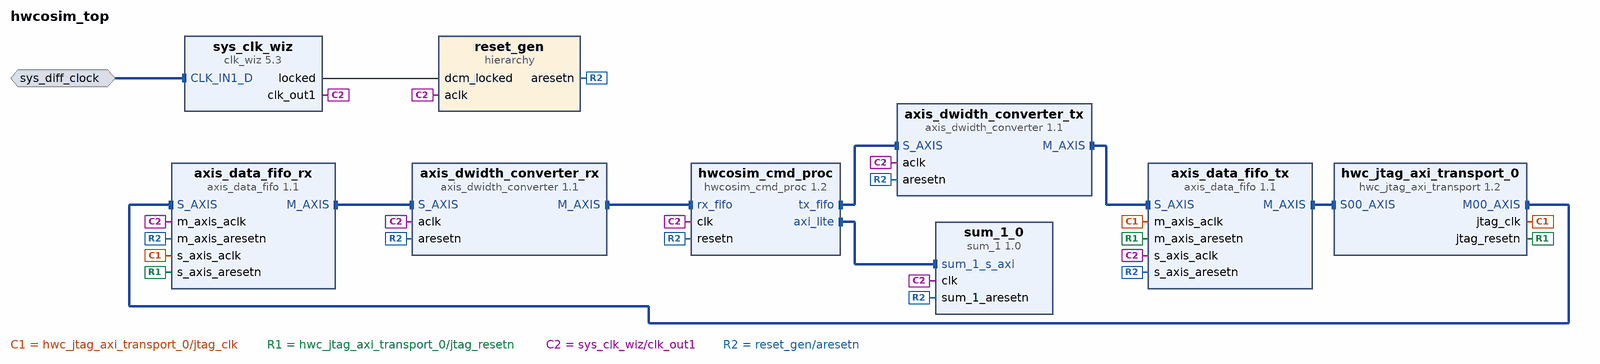
[diagram p0: block diagram of the top level]
# Vivado block design hwcosim_top, Vivado 2016.1
create_bd_design hwcosim_top

create_bd_intf_port -mode Slave -vlnv xilinx.com:interface:diff_clock_rtl:1.0 sys_diff_clock
set_property -dict {CONFIG.FREQ_HZ 200000000} [get_bd_intf_ports sys_diff_clock]

create_bd_cell -type ip -vlnv xilinx.com:ip:clk_wiz:5.3 sys_clk_wiz
set_property -dict [list \
  CONFIG.CLKOUT1_REQUESTED_OUT_FREQ 50.000 \
  CONFIG.MMCM_DIVCLK_DIVIDE 1 \
  CONFIG.MMCM_CLKFBOUT_MULT_F 5.000 \
  CONFIG.MMCM_CLKOUT0_DIVIDE_F 20.000 \
  CONFIG.USE_BOARD_FLOW true \
  CONFIG.CLK_IN1_BOARD_INTERFACE sys_diff_clock \
  CONFIG.CLKOUT1_JITTER 129.198 \
  CONFIG.CLKOUT1_PHASE_ERROR 89.971 \
] [get_bd_cells sys_clk_wiz]
create_bd_cell -type ip -vlnv xilinx.com:hwcosim:hwc_jtag_axi_transport:1.2 hwc_jtag_axi_transport_0
set_property -dict {CONFIG.HWC_JTAG_SCAN_CHAIN 2} [get_bd_cells hwc_jtag_axi_transport_0]
create_bd_cell -type ip -vlnv xilinx.com:ip:axis_data_fifo:1.1 axis_data_fifo_rx
set_property -dict [list \
  CONFIG.TDATA_NUM_BYTES 1 \
  CONFIG.FIFO_DEPTH 4096 \
  CONFIG.IS_ACLK_ASYNC 1 \
  CONFIG.HAS_TLAST 1 \
] [get_bd_cells axis_data_fifo_rx]
create_bd_cell -type ip -vlnv xilinx.com:ip:axis_data_fifo:1.1 axis_data_fifo_tx
set_property -dict [list \
  CONFIG.TDATA_NUM_BYTES 1 \
  CONFIG.FIFO_DEPTH 4096 \
  CONFIG.IS_ACLK_ASYNC 1 \
  CONFIG.HAS_TLAST 1 \
] [get_bd_cells axis_data_fifo_tx]
create_bd_cell -type ip -vlnv xilinx.com:ip:axis_dwidth_converter:1.1 axis_dwidth_converter_rx
set_property -dict {CONFIG.M_TDATA_NUM_BYTES 4} [get_bd_cells axis_dwidth_converter_rx]
create_bd_cell -type ip -vlnv xilinx.com:hwcosim:hwcosim_cmd_proc:1.2 hwcosim_cmd_proc
set_property -dict {CONFIG.C_AXI_ADDR_W 7 CONFIG.INTERFACE 0} [get_bd_cells hwcosim_cmd_proc]
create_bd_cell -type ip -vlnv xilinx.com:ip:axis_dwidth_converter:1.1 axis_dwidth_converter_tx
set_property -dict {CONFIG.S_TDATA_NUM_BYTES 4 CONFIG.M_TDATA_NUM_BYTES 1} [get_bd_cells axis_dwidth_converter_tx]
create_bd_cell -type hier reset_gen
create_bd_cell -type ip -vlnv User_Company:SysGen:sum_1:1.0 sum_1_0

# ---- hierarchy /reset_gen ----
current_bd_instance /reset_gen
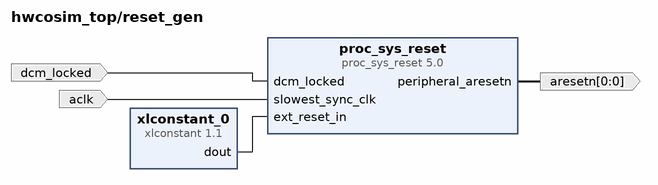
[diagram p1: block diagram inside /reset_gen]
create_bd_pin -dir I dcm_locked
create_bd_pin -dir I aclk
create_bd_pin -dir O -from 0 -to 0 aresetn

create_bd_cell -type ip -vlnv xilinx.com:ip:proc_sys_reset:5.0 proc_sys_reset
create_bd_cell -type ip -vlnv xilinx.com:ip:xlconstant:1.1 xlconstant_0

# ---- connections ----

current_bd_instance /reset_gen
connect_bd_net [get_bd_pins dcm_locked] [get_bd_pins proc_sys_reset/dcm_locked]
connect_bd_net [get_bd_pins aclk] [get_bd_pins proc_sys_reset/slowest_sync_clk]
connect_bd_net [get_bd_pins proc_sys_reset/peripheral_aresetn] [get_bd_pins aresetn]
connect_bd_net [get_bd_pins xlconstant_0/dout] [get_bd_pins proc_sys_reset/ext_reset_in]

current_bd_instance /
connect_bd_intf_net [get_bd_intf_pins hwc_jtag_axi_transport_0/M00_AXIS] [get_bd_intf_pins axis_data_fifo_rx/S_AXIS]
connect_bd_intf_net [get_bd_intf_pins axis_data_fifo_tx/M_AXIS] [get_bd_intf_pins hwc_jtag_axi_transport_0/S00_AXIS]
connect_bd_intf_net [get_bd_intf_pins axis_data_fifo_rx/M_AXIS] [get_bd_intf_pins axis_dwidth_converter_rx/S_AXIS]
connect_bd_intf_net [get_bd_intf_pins axis_dwidth_converter_rx/M_AXIS] [get_bd_intf_pins hwcosim_cmd_proc/rx_fifo]
connect_bd_intf_net [get_bd_intf_pins hwcosim_cmd_proc/tx_fifo] [get_bd_intf_pins axis_dwidth_converter_tx/S_AXIS]
connect_bd_intf_net [get_bd_intf_pins axis_dwidth_converter_tx/M_AXIS] [get_bd_intf_pins axis_data_fifo_tx/S_AXIS]
connect_bd_intf_net [get_bd_intf_pins hwcosim_cmd_proc/axi_lite] [get_bd_intf_pins sum_1_0/sum_1_s_axi]
connect_bd_intf_net [get_bd_intf_ports sys_diff_clock] [get_bd_intf_pins sys_clk_wiz/CLK_IN1_D]
connect_bd_net [get_bd_pins hwc_jtag_axi_transport_0/jtag_clk] [get_bd_pins axis_data_fifo_rx/s_axis_aclk] [get_bd_pins axis_data_fifo_tx/m_axis_aclk]
connect_bd_net [get_bd_pins hwc_jtag_axi_transport_0/jtag_resetn] \
  [get_bd_pins axis_data_fifo_rx/s_axis_aresetn] [get_bd_pins axis_data_fifo_tx/m_axis_aresetn]
connect_bd_net -net sys_clk_net [get_bd_pins sys_clk_wiz/clk_out1] \
  [get_bd_pins hwcosim_cmd_proc/clk] [get_bd_pins axis_dwidth_converter_rx/aclk] [get_bd_pins axis_dwidth_converter_tx/aclk] \
  [get_bd_pins axis_data_fifo_rx/m_axis_aclk] [get_bd_pins axis_data_fifo_tx/s_axis_aclk] [get_bd_pins reset_gen/aclk] \
  [get_bd_pins sum_1_0/clk]
connect_bd_net [get_bd_pins sys_clk_wiz/locked] [get_bd_pins reset_gen/dcm_locked]
connect_bd_net [get_bd_pins reset_gen/aresetn] \
  [get_bd_pins axis_dwidth_converter_rx/aresetn] [get_bd_pins axis_dwidth_converter_tx/aresetn] \
  [get_bd_pins axis_data_fifo_rx/m_axis_aresetn] [get_bd_pins axis_data_fifo_tx/s_axis_aresetn] \
  [get_bd_pins hwcosim_cmd_proc/resetn] [get_bd_pins sum_1_0/sum_1_aresetn]

validate_bd_design
save_bd_design
